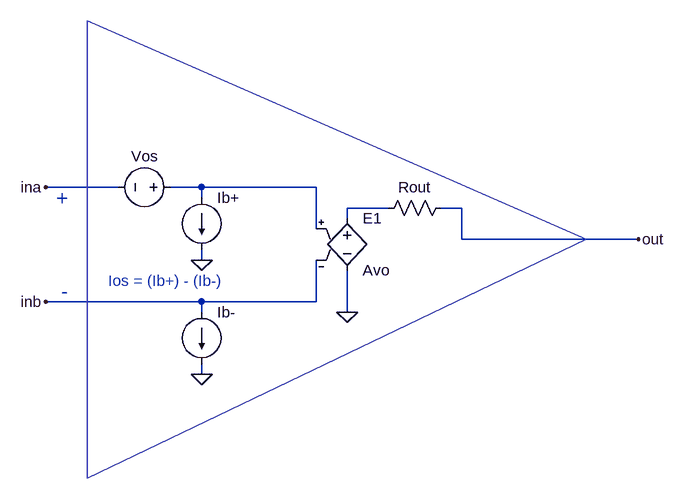
[diagram p0: schematic discrete-opamp3-fig3.asc]
discrete-opamp3-fig3.asc, the LTspice schematic file:
Version 4
SHEET 1 3556 680
WIRE 1696 48 1584 48
WIRE 1824 48 1776 48
WIRE 2000 48 1824 48
WIRE 1824 64 1824 48
WIRE 2112 80 2048 80
WIRE 2224 80 2192 80
WIRE 2048 96 2048 80
WIRE 2000 112 2000 48
WIRE 2224 128 2224 80
WIRE 2496 128 2224 128
WIRE 1824 160 1824 144
WIRE 1824 224 1584 224
WIRE 2000 224 2000 160
WIRE 2000 224 1824 224
WIRE 1824 240 1824 224
WIRE 2048 240 2048 176
WIRE 1824 336 1824 320
FLAG 1824 160 0
FLAG 1824 336 0
FLAG 2496 128 out
FLAG 2048 240 0
FLAG 1584 48 ina
FLAG 1584 224 inb
SYMBOL current 1824 64 R0
SYMATTR InstName Ib+
SYMATTR Value ""
SYMBOL current 1824 240 R0
SYMATTR InstName Ib-
SYMATTR Value ""
SYMBOL voltage 1792 48 R90
WINDOW 0 -32 56 VBottom 2
WINDOW 3 32 56 VTop 2
SYMATTR InstName Vos
SYMATTR Value ""
SYMBOL e 2048 80 R0
SYMATTR InstName E1
SYMATTR Value Avo
SYMBOL res 2208 64 R90
WINDOW 0 0 56 VBottom 2
WINDOW 3 32 56 VTop 2
SYMATTR InstName Rout
SYMATTR Value ""
TEXT 1680 192 Left 2 ;Ios = (Ib+) - (Ib-)
TEXT 1600 64 Left 3 ;+
TEXT 1608 208 Left 3 ;-
LINE Normal 1648 -208 2416 128
LINE Normal 1648 496 1648 -208
LINE Normal 2416 128 1648 496

The netlist it stands for:
* discrete-opamp3-fig3.asc
Ib+ N001 0
Ib- inb 0
Vos N001 ina
E1 N002 0 N001 inb Avo
Rout out N002
* Ios = (Ib+) - (Ib-)
* +
* -
.backanno
.end